# Altium schematic sheet Free Pins Headers.SchDoc
size A4
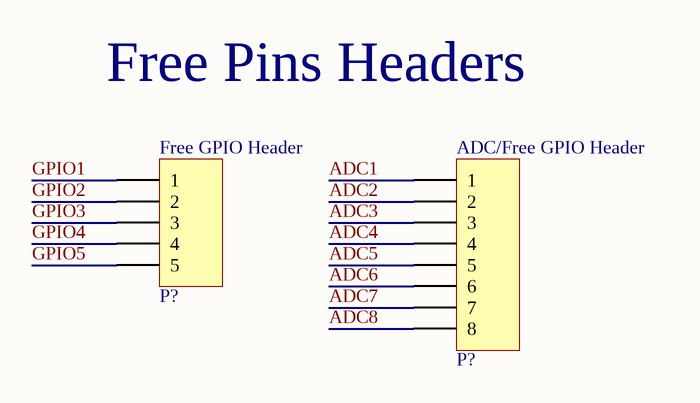
[diagram p0: Free Pins Headers.SchDoc]

## Parts
(Parts that share a designator on the sheet are numbered #1, #2 ... from top to bottom, then left to right.)
P?#1  HDR1X5  [HDR1X5]  (value not drawn)
P?#2  HDR1X8  [HDR1X8]  (value not drawn)

## Nets
ADC1: P?#2.1
ADC2: P?#2.2
ADC3: P?#2.3
ADC4: P?#2.4
ADC5: P?#2.5
ADC6: P?#2.6
ADC7: P?#2.7
ADC8: P?#2.8
GPIO1: P?#1.1
GPIO2: P?#1.2
GPIO3: P?#1.3
GPIO4: P?#1.4
GPIO5: P?#1.5

## Notes on the sheet
- Free Pins Headers
- (near P?#1) Free GPIO Header
- (near P?#2) ADC/Free GPIO Header

## Library data of the parts
P?#1 = HDR1X5: Header, 5-Pin; LatestRevisionDate: 17-Jul-2002; LatestRevisionNote: Re-released for DXP Platform.; Publisher: Altium Limited
P?#2 = HDR1X8: Header, 8-Pin; LatestRevisionDate: 17-Jul-2002; LatestRevisionNote: Re-released for DXP Platform.; Publisher: Altium Limited